# Altium schematic sheet LED Indicators.SchDoc
size A4
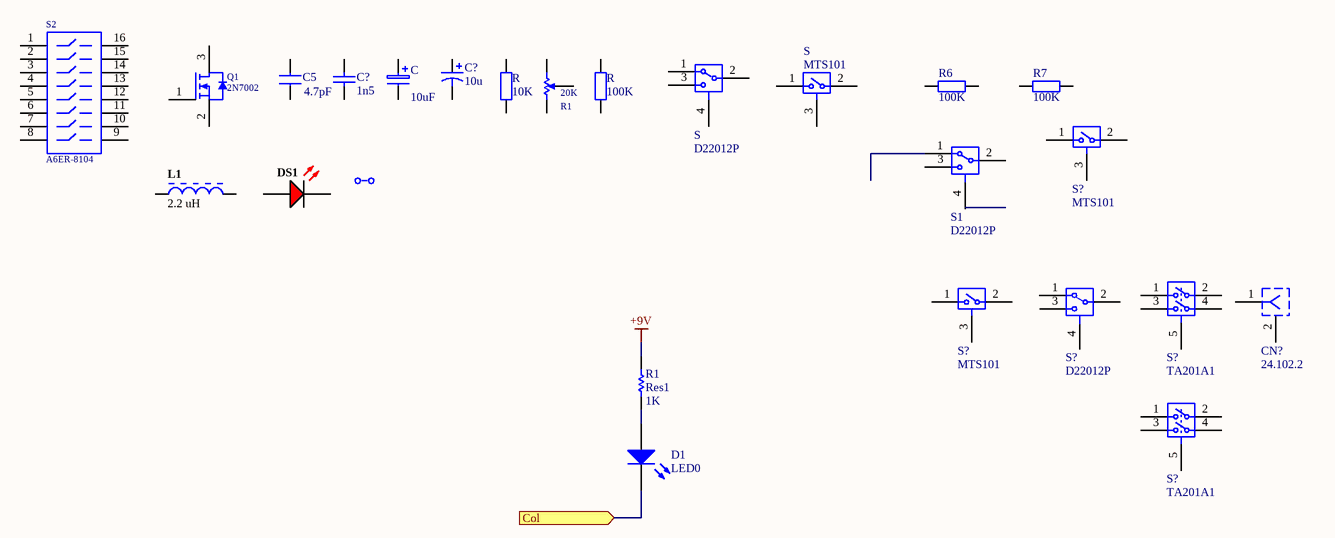
[diagram p0: LED Indicators.SchDoc]

## Parts
(Parts that share a designator on the sheet are numbered #1, #2 ... from top to bottom, then left to right.)
C  10uF  [1206]
C5  4.7pF  [0805]
C?#1  10u  [CAPPR200-500x1100]
C?#2  1n5  [CAPC3216[1206]M]
CN?  Manufacturer Part Number: 24.102.2  (hidden comment: Conn Banana_24.102.2_multicomp)
D1  LED0  [LED-0]
DS1  APG1608SURKC/T  [KING-0603(1608)25-Red]  (value not drawn)
JS3  Shorting Link  (value not drawn)  (mechanical)
L1  Inductance: 2.2 uH  [BOUR-SRU2013-2R2Y-2_V]  (hidden comment: SRU2013-2R2Y)
Q1  2N7002  [SO-G3]
R1#1  20K  [POT4MM-2]
R1#2  Res1  value 1K  [AXIAL-0.3]
R6  Resistance: 100K  [Res-C_1210-(3225)x07_Least_Reflow_Altium IPC+SEI]  (hidden comment: Resistor-Chip_1210)
R7  Resistance: 100K  [Res-C_1210-(3225)x07_Least_Reflow_Altium IPC+SEI]  (hidden comment: Resistor-Chip_1210)
R#1  10K  [RESC2012[0805]M]
R#2  Resistance: 100K  [Res-C_1210-(3225)x07_Least_Reflow_Altium IPC+SEI]  (hidden comment: Resistor-Chip_1210)
S1  Manufacturer Part Number: D22012P  [Sw-Toggle_D22012P_SPDT_MHD6,5_PQ3]  (hidden comment: Switch Toggle_D22012_DPST)
S2  A6ER-8104  [DIP-16-KEY]
S#1  Manufacturer Part Number: D22012P  [Sw-Toggle_D22012P_SPDT_MHD6,5_PQ3]  (hidden comment: Switch Toggle_D22012_DPST)
S#2  Manufacturer Part Number: MTS101  [Sw-Toggle_MTS-101_SPST_MHD6,5_PQ2]  (hidden comment: Switch Toggle_MTS-101_SPST)
S?#1  Manufacturer Part Number: MTS101  [Sw-Toggle_MTS-101_SPST_MHD6,5_PQ2]  (hidden comment: Switch Toggle_MTS-101_SPST)
S?#2  Manufacturer Part Number: MTS101  [Sw-Toggle_MTS-101_SPST_MHD6,5_PQ2]  (hidden comment: Switch Toggle_MTS-101_SPST)
S?#3  Manufacturer Part Number: D22012P  [Sw-Toggle_D22012P_SPDT_MHD6,5_PQ3]  (hidden comment: Switch Toggle_D22012_DPST)
S?#4  Manufacturer Part Number: TA201A1  (hidden comment: Switch Toggle_TA201A1_DPST)
S?#5  Manufacturer Part Number: TA201A1  (hidden comment: Switch Toggle_TA201A1_DPST)

## Ports
Col (in)

## Nets
+9V: R1#2.1
Col: D1.2(K) ; port Col
NetD1_1: D1.1(A) R1#2.2

Not connected (* = marked no-connect by the designer): C 1 2; C5 1 2; C?#1 1 2; C?#2 1 2; CN? 1 2; DS1 1(A) 2(K); L1 1 2; Q1 1 2 3; R1#1 CCW(-) CW(+) W; R6 1 2; R7 1 2; R#1 1 2; R#2 1 2; S1 1 2 3 4; S2 1 2 3 4 5 6 7 8 9 10 11 12 13 14 15 16; S#1 1 2 3 4; S#2 1 2 3; S?#1 1 2 3; S?#2 1 2 3; S?#3 1 2 3 4; S?#4 1 2 3 4 5; S?#5 1 2 3 4 5

## Library data of the parts
C = CAP3: Capacitor; Value: 10uF
C5 = CAP: Capacitor; Value: 4.7pF
C?#1 = CAPPR_10u_5x11_Elyt_50V: CAPACITOR Aluminum Electrolytic 10uF; 50V; D5mm, H11mm, P2mm; Low ESR; Tolerance. +/-20%; Temp.op. -40°C to +105°C; Value: 10000000pF; ComponentLink1Description: Datasheet [pdf]; ComponentLink1URL: http://cvs.tess.elex.be/cgi-bin/cvsweb/~checkout~/business_units/technology_development/HW_Groups/datasheets/Capacitors/TH_Polarized/CAP_Elyt_LowESR_Rubycon_YXF.pdf?rev=1.1; Published: 2007-07-26; Publisher: PDS; Voltage: 50V; MLX P/N: CAPPR_10u_5x11_Elyt_50V
C?#2 = CAPC_1n5_1206: CAPACITOR Ceramic Multi-Layer X7R; 1.5nF; 50V; 1206; Tolerance, +/-10%; Temp, op. -55°C to +125°C; Value: 1500p; Published: 2007-07-31; Publisher: PDS; ComponentLink1Description: Datasheet [pdf]; ComponentLink1URL: http://cvs.tess.elex.be/cgi-bin/cvsweb/~checkout~/business_units/technology_development/HW_Groups/datasheets/Capacitors/SMD_Ceramic/smccp.pdf?rev=1.1; Voltage: 50V; MLX P/N: CAPC_1n5_1206
CN? = Conn Banana_24.102.2_multicomp: Connector; Banana; Female; Black; 6A 30Vac; Body 12x12x24mm_multicomp; Manufacturer, Producer: multikomp; Mounting Type, Technology: Panel Mount; Gender: Receptacle (Female); Published: 2015-10-27; Publisher: Aydan Halilov; ComponentLink1Description: Datasheet [pdf] xxx; ComponentLink1URL: http:// xxx; HelpURL: C:\xxx; Component, Part Category, Type: Connector; Operating 't Range: -; Package, Case: -; Size, Dimensions: 12x12x24mm; Note: -; Lead Free Status / RoHS Status: Lead free / RoHS Compliant; Family: Test Socket (Banana); Composition: Brass body nickel plated with ABS housing; Number of Terminations: 1; Value: 24.102.2; Termination Style: Solder Lug; Current Rating: 6A; Voltage Rating: 30Vac; Color: Black
D1 = LED0: Typical INFRARED GaAs LED; Published: 8-Jun-2000; LatestRevisionDate: 08-Jul-2005; LatestRevisionNote: Mech Layer 1 removed.; PackageReference: LED-0; Publisher: Altium Limited; PackageDescription: LED; 2 Leads
DS1 = CMP-5037-00006-1: LED, SMT, 0603(1608), 0.25mm thickness, Red; Power Dissipation: 75 mW; IEC-class: Light emitting diodes; Reverse Voltage: 5 V; Forward Current: 30 mA; Class: Optoelectronic; Packing Type: 2000 pcs / reel; Storage Temperature: -40 to +85 degC; Sub-class: LED; Datasheet: http://www.kingbrightusa.com/images/catalog/spec/APG1608SURKC-T.pdf
JS3 = Jumper Socket: Shorting Link, 2.54mm (0.1") Pitch
L1 = CMP-0462-00001-1: Power Inductor, 2.2 uH, 1.45 Irms Max(A), SMD; Manufacturer: Bourns; Frequency - Self Resonant: 100 MHz; Current - Saturation: 950 mA; Current Rating: 1.45 A; DC Resistance (DCR): 120 mOhm Max; Tolerance: +/-30%; PackageReference: SRU2013-2R2Y-2; PackageDescription: 2-Pin Hand Drawn, Body 2.8 x 2.8 mm; ComponentLink3URL: http://www.bourns.com/data/global/pdfs/SRU2013.pdf; ComponentLink3Description: Package Specification; Operating Temperature: -40 to 125 degC; ComponentLink2Description: Datasheet; ComponentLink2URL: http://www.bourns.com/data/global/pdfs/SRU2013.pdf; Mounting Technology: Surface Mount; PartNumber: SRU2013-2R2Y; DatasheetVersion: 2/13/2013; ComponentLink1Description: Manufacturer URL; ComponentLink1URL: http://www.bourns.com
Q1 = 2N7002: N Channel Mosfet
R1#1 = RPot SM: Square Trimming Potentiometer; AEMS Code: 1400226
R1#2 = Res1: Resistor; Published: 8-Jun-2000; LatestRevisionDate: 17-Jul-2002; LatestRevisionNote: Re-released for DXP Platform.; PackageReference: AXIAL-0.3; Publisher: Altium Limited; PackageDescription: Axial Device, Thru-Hole; 2 Leads; 0.3 in Pin Spacing
R6 R7 = Resistor-Chip_1210: Resistor Thick Film; 100K; 1210; 0,5W; 1%; 200V; 100ppm/DegC; Operating 't Range: -55~155°C; Package, Case: 1210 (3225 Metric); Mounting Type, Technology: SMD; Power: 0,5W; Automotive Grade: Automotive AEC-Q200; Temperature Coefficient: -100ppm/°C; Published: 2015-10-21; Publisher: Aydan Halilov; ComponentLink1Description: Datasheet [pdf] xxx; ComponentLink1URL: http:// xxx; Value: 100K; Tolerance: 1%; Manufacturer, Producer: -; HelpURL: C:\xxx; Component, Part Category, Type: Resistor; Size, Dimensions: 3,2x2,5x0,7mm; Manufacturer Part Number: -; Note: -; Lead Free Status / RoHS Status: Lead free / RoHS Compliant; Family: Chip Resistor - Surface Mount; Series: -; Composition: Thick Film; Number of Terminations: 2
R#1 = RESC_10K_0805: Resistor Thick Film; 10K; 0805; 0.125W; 1%; 150V; 100ppm/DegC; Value: 10000R; Published: 2008-04-17; Publisher: PDS; ComponentLink1Description: Datasheet [pdf]; ComponentLink1URL: http://cvs.tess.elex.be/cgi-bin/cvsweb/~checkout~/business_units/technology_development/HW_Groups/datasheets/Resistors/SMD/SMD_Resistors.pdf?rev=1.1; MLX P/N: RESC_10K_0805; Tolerance: 1%
R#2 = Resistor-Chip_1210: Resistor Thick Film; 100K; 1210; 0,5W; 1%; 200V; 100ppm/DegC; Operating 't Range: -55~155°C; Package, Case: 1210 (3225 Metric); Power: 0,5W; Automotive Grade: Automotive AEC-Q200; Temperature Coefficient: -100ppm/°C; Mounting Type, Technology: SMD; Published: 2015-10-21; Publisher: Aydan Halilov; ComponentLink1Description: Datasheet [pdf] xxx; ComponentLink1URL: http:// xxx; Value: 100K; Tolerance: 1%; Manufacturer, Producer: -; HelpURL: C:\xxx; Component, Part Category, Type: Resistor; Size, Dimensions: 3,2x2,5x0,7mm; Manufacturer Part Number: -; Note: -; Lead Free Status / RoHS Status: Lead free / RoHS Compliant; Family: Chip Resistor - Surface Mount; Series: -; Composition: Thick Film; Number of Terminations: 2
S1 S#1 S?#3 = Switch Toggle_D22012_DPST: Switch Toggle; Double Pole and Single Throw, 6A 125Vac, Body 13,2x7,9x33mm; Operating 't Range: -25~+85°C; Mounting Type, Technology: Panel Mount; Automotive Grade: Automotive AEC-Q200; Contact Resistance max: 20mohm; Insulation Resistance min: 500Vdc 1Tohm; Electrical Life: 10 000 cycles; Rating: 6A 125Vac; 3A 250Vac; Dielectric Strength: 1 minute 1500Vac; Value: MTS-101; Circuit: SPST; Published: 2015-10-22; Publisher: Aydan Halilov; ComponentLink1Description: Datasheet [pdf] xxx; ComponentLink1URL: http:// xxx; Manufacturer, Producer: -; HelpURL: C:\xxx; Component, Part Category, Type: Switch; Package, Case: -; Size, Dimensions: 13,2x7,9x33mm; Note: -; Lead Free Status / RoHS Status: Lead free / RoHS Compliant; Family: Toggle Switch; Composition: metal & plastic; Number of Terminations: 2; Termination Style: Solder Lug
S2 = A6ER-8104: DIP Switch Side actuator long liver Piano Key; Revision: July-2002: Re-released for DXP Platform.
S#2 S?#1 S?#2 = Switch Toggle_MTS-101_SPST: Switch Toggle; Single Pole and Single Throw; 6A 125Vac; 3A 250Vac; Body 13,2x7,9x33mm; Operating 't Range: -25~+85°C; Mounting Type, Technology: Panel Mount; Contact Resistance max: 20mohm; Insulation Resistance min: 500Vdc 1Tohm; Electrical Life: 10 000 cycles; Dielectric Strength: 1 minute 1500Vac; Circuit: SPST; Published: 2015-10-22; Publisher: Aydan Halilov; ComponentLink1Description: Datasheet [pdf] xxx; ComponentLink1URL: http:// xxx; Manufacturer, Producer: -; HelpURL: C:\xxx; Component, Part Category, Type: Switch; Package, Case: -; Size, Dimensions: 13,2x7,9x33mm; Note: -; Lead Free Status / RoHS Status: Lead free / RoHS Compliant; Family: Toggle Switch; Composition: metal & plastic; Number of Terminations: 2; Rating: 6A 125Vac; 3A 250Vac; Value: MTS-101; Termination Style: Solder Lug
S?#4 S?#5 = Switch Toggle_TA201A1_DPST: Switch Toggle; Double Pole and Singlele Throw; 6A 125Vac; 3A 250Vac; Body 13x12x35,8mm; Mounting Type, Technology: Panel Mount; Contact Resistance max: 50mohm; Insulation Resistance min: 500Vdc 500Mohm; Dielectric Strength: 1 minute 1000Vac; Circuit: DPST; Published: 2015-10-26; Publisher: Aydan Halilov; ComponentLink1Description: Datasheet [pdf] xxx; ComponentLink1URL: http:// xxx; Manufacturer, Producer: -; HelpURL: C:\xxx; Component, Part Category, Type: Switch; Operating 't Range: -; Package, Case: -; Size, Dimensions: 13x12x35,8mm; Note: -; Lead Free Status / RoHS Status: Lead free / RoHS Compliant; Family: Toggle Switch; Composition: metal & plastic; Number of Terminations: 4; Electrical Life: -; Rating: 6A 125Vac; 3A 250Vac; Value: TA201A1; Termination Style: Solder Lug; Series: 55